# Altium schematic sheet [07] - POWER.SchDoc: Project
size A4; Organization: Tor Brodtkorb; Address1: Frode Rinnans veg 193; Address2: 7050 Trondheim; DocumentNumber: 6598; Revision: 1.0; SheetNumber: 1; SheetTotal: 1
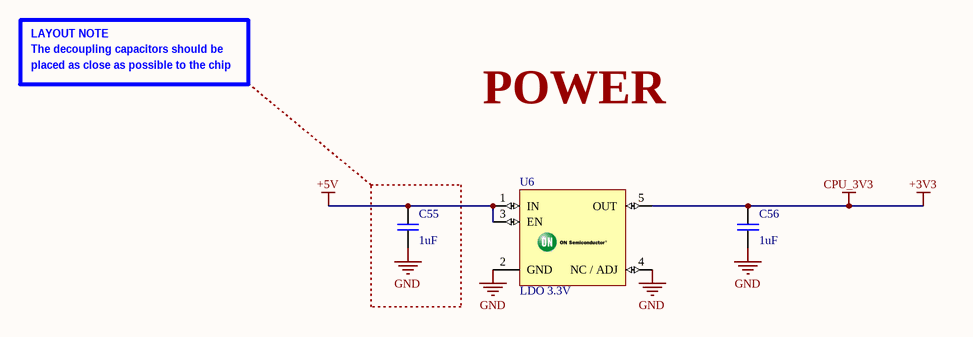
[diagram p0: [07] - POWER.SchDoc]

## Parts
C55  value 1uF  [C0603]  (hidden comment: 02016D104KAT2A)
C56  value 1uF  [C0603]  (hidden comment: 02016D104KAT2A)
U6  LDO 3.3V  [NCV8161BSN330T1G]

## Nets
+3V3: C56.2 U6.5(OUT)  [also labelled CPU_3V3]
+5V: C55.2 U6.1(IN) U6.3(EN)
GND: C55.1 C56.1 U6.2(GND) U6.4(NC_/_ADJ)

## Notes on the sheet
- LAYOUT NOTE
- The decoupling capacitors should be
- placed as close as possible to the chip
- POWER
- Title
- Size:
- Date:
- A4
- Number:
- Time:
- Revision:
- Sheet
- of
- File:

## Library data of the parts
C55 C56 = 02016D104KAT2A: C0603
U6 = NCV8161BSN330T1G: 3.3V fixed output LDO, < 10uVrms